# Altium schematic sheet PowerAndConnections.SchDoc: Sample Sheet Title
size B; Date: MM/DD/YYYY; Author: Sample Author; Organization: ORGANIZATION; Address1: ADDRESS 1; Address2: ADDRESS 2; Address3: ADDRESS 3; Address4: ADDRESS 4; Revision: -; SheetNumber: 1; SheetTotal: 6; ENG_APP_DATE: --/--/--; DSN_APP_DATE: --/--/--; CHK_APP_DATE: --/--/--
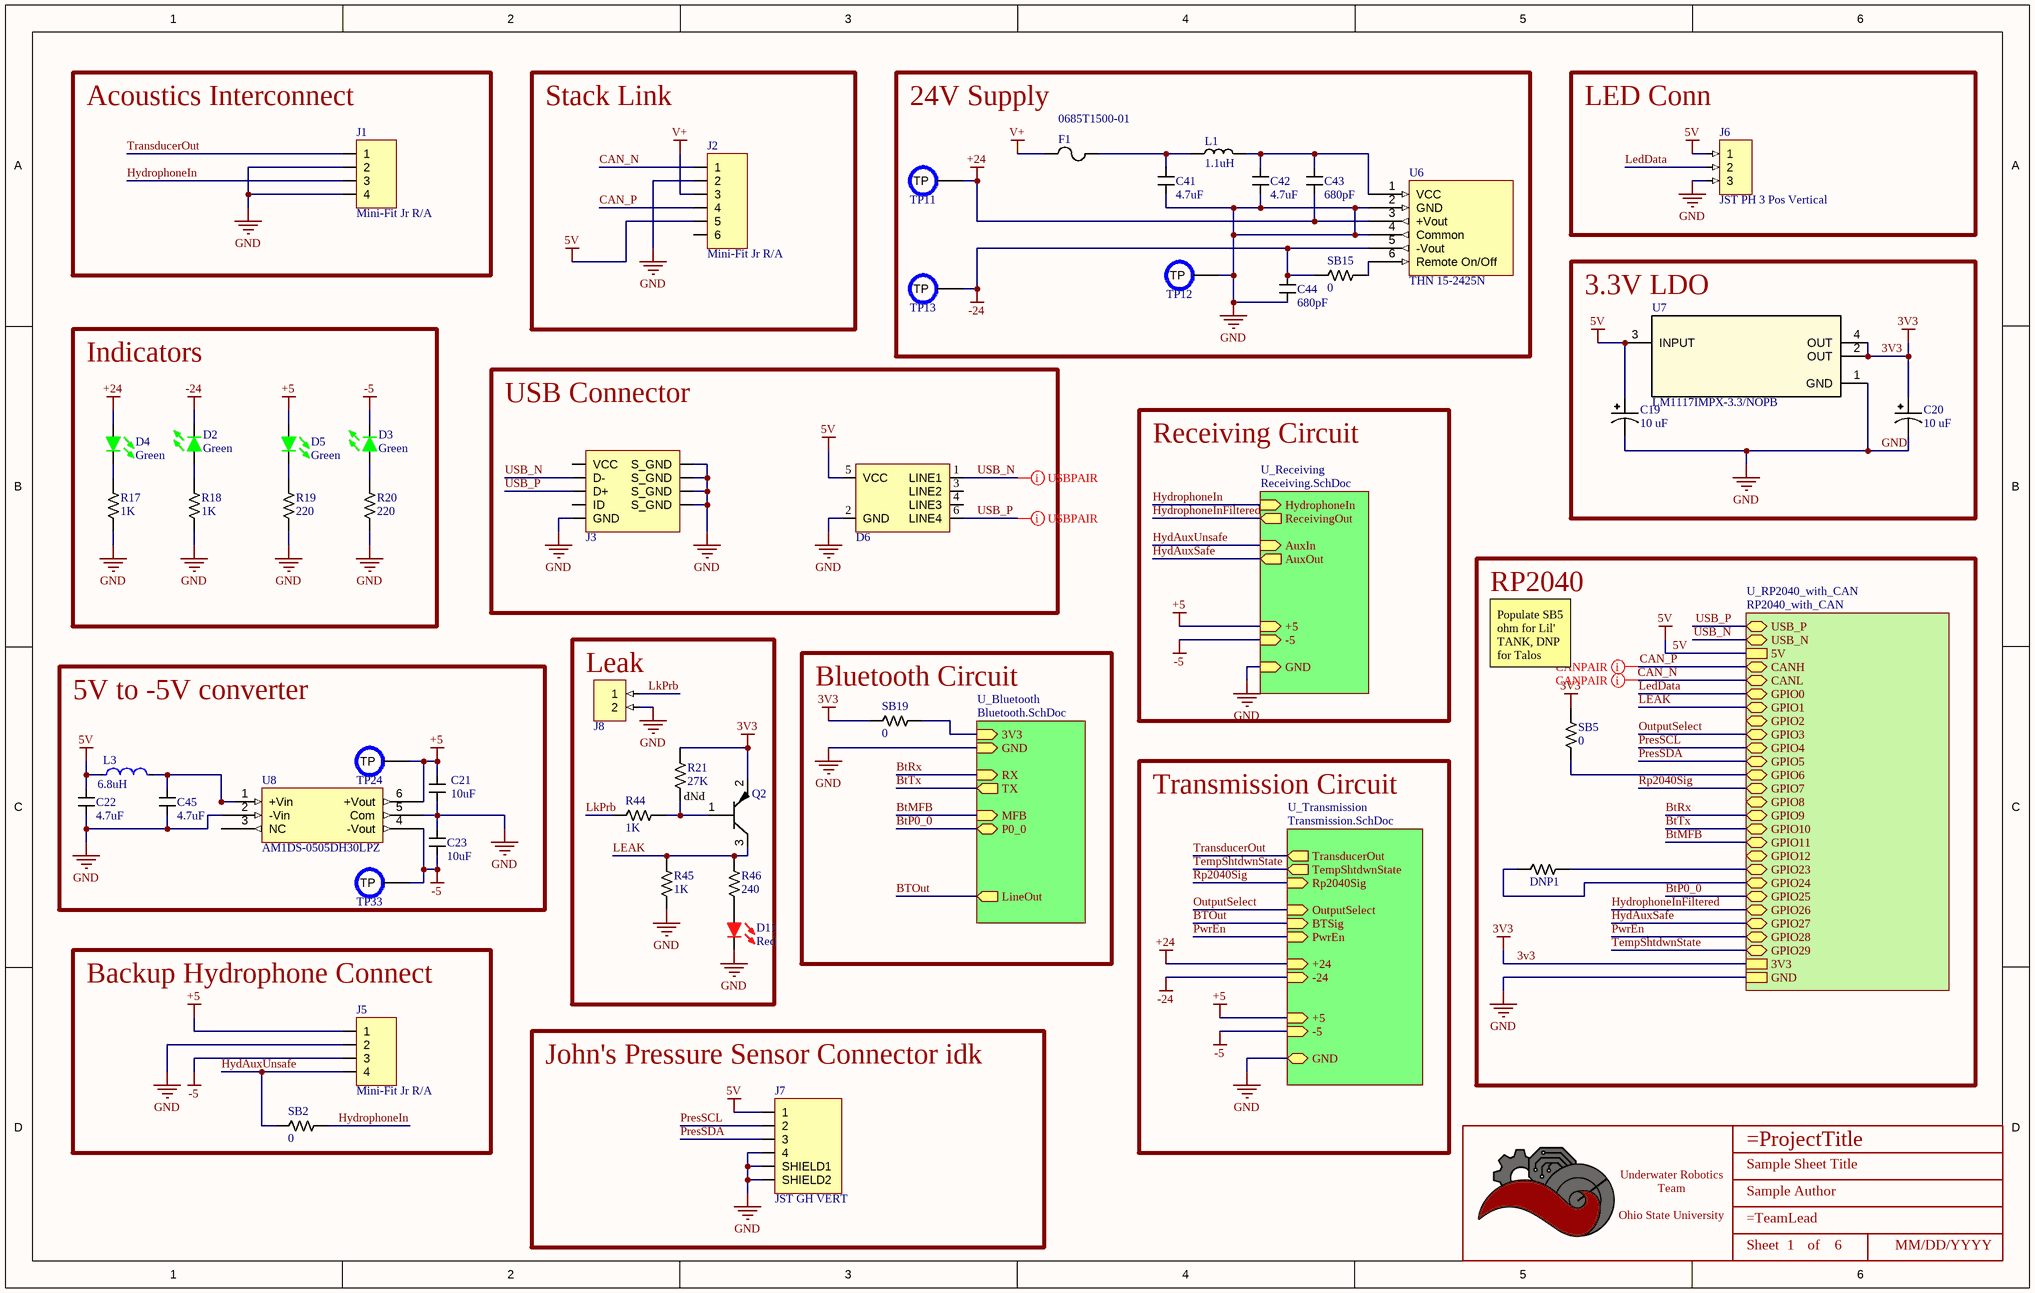
[diagram p0: PowerAndConnections.SchDoc]

## Parts
*  Title_Block  [LOGO]  (value not drawn)  (graphical)
C19  Value (uF): 10 uF  [CAPACITOR_1206 - POLAR]  (hidden comment: 10uF Tantalum 16V)
C20  Value (uF): 10 uF  [CAPACITOR_1206 - POLAR]  (hidden comment: 10uF Tantalum 16V)
C21  value 10uF  [CAPACITOR_0603]  (hidden comment: CL10X106MO8NRNC)
C22  value 4.7uF  [CAPACITOR_0603]  (hidden comment: 4.7uF Ceramic 6.3V)
C23  value 10uF  [CAPACITOR_0603]  (hidden comment: CL10X106MO8NRNC)
C41  value 4.7uF  [CAPACITOR_1206]  (hidden comment: AGC1206X7R500-475KXE*)
C42  value 4.7uF  [CAPACITOR_1206]  (hidden comment: AGC1206X7R500-475KXE*)
C43  value 680pF  [CAPACITOR_1808]  (hidden comment: CC1808KKX7REBB681)
C44  value 680pF  [CAPACITOR_1808]  (hidden comment: CC1808KKX7REBB681)
C45  value 4.7uF  [CAPACITOR_0603]  (hidden comment: 4.7uF Ceramic 6.3V)
D2  Color: Green  [LED_0603]  (hidden comment: 150060GS75000)
D3  Color: Green  [LED_0603]  (hidden comment: 150060GS75000)
D4  Color: Green  [LED_0603]  (hidden comment: 150060GS75000)
D5  Color: Green  [LED_0603]  (hidden comment: 150060GS75000)
D6  TVS DIODE 5VWM 25VC SOT23-6  [SOT 23-6L]  (value not drawn)
D11  Color: Red  [LED_0603]  (hidden comment: 150060RS75000)
DNP1  DNP  [RESISTOR_0402]  (value not drawn)
F1  0685T1500-01  [CAPACITOR_1206]
J1  Mini-Fit Jr R/A  [CONN_MOLEX_MINIFIT JR_4 POS_R/A]
J2  Mini-Fit Jr R/A  [CONN_MOLEX_MINIFIT JR_6 POS_R/A]
J3  USB_MICRO R/A  [CONN_MINIUSB]  (value not drawn)
J5  Mini-Fit Jr R/A  [CONN_MOLEX_MINIFIT JR_4 POS_R/A]
J6  JST PH 3 Pos Vertical  [CONN_JST_PH_3POS_VERT]
J7  JST GH VERT  [CONN_JST_BM04B-GHS-TBT(LF)(SN)(N)]
J8  CONN_JST_PH_2POS_VERT  [CONN_JST_PH_2POS_VERT]  (value not drawn)
L1  value 1.1uH  [INDUCTOR_TCK078]  (hidden comment: TCK-078)
L3  value 6.8uH  [INDUCTOR_0805]  (hidden comment: MLZ2012N6R8LT000)
Q2  PNP 60V 600mA SOT23  [SOT-23-3]  (value not drawn)
R17  Value  (Ohms): 1K  [RESISTOR_0603]  (hidden comment: 1k Ohm 5% 1/8W)
R18  Value  (Ohms): 1K  [RESISTOR_0603]  (hidden comment: 1k Ohm 5% 1/8W)
R19  Value  (Ohms): 220  [RESISTOR_0603]  (hidden comment: 220 Ohm 5% 1/8W)
R20  Value  (Ohms): 220  [RESISTOR_0603]  (hidden comment: 220 Ohm 5% 1/8W)
R21  Value  (Ohms): 27K  [RESISTOR_0603]  (hidden comment: 27k Ohm 5% 1/8W)
R44  Value  (Ohms): 1K  [RESISTOR_0603]  (hidden comment: 1k Ohm 5% 1/8W)
R45  Value  (Ohms): 1K  [RESISTOR_0603]  (hidden comment: 1k Ohm 5% 1/8W)
R46  Value  (Ohms): 240  [RESISTOR_0603]  (hidden comment: RES SMD 240 OHM 5% 1/10W 0603)
SB2  Value  (Ohms): 0  [RESISTOR_0603]  (hidden comment: 0 Ohm Jumper No Fit)
SB5  Value  (Ohms): 0  [RESISTOR_0603]  (hidden comment: 0 Ohm Jumper No Fit)
SB15  value 0  [RESISTOR_1206]  (hidden comment: JUMPER_0_1206)
SB19  Value  (Ohms): 0  [RESISTOR_0603]  (hidden comment: 0 Ohm Jumper No Fit)
TP11  PCB Test Point  [TESTPOINT_1.2MM]  (value not drawn)  (no BOM)
TP12  PCB Test Point  [TESTPOINT_1.2MM]  (value not drawn)  (no BOM)
TP13  PCB Test Point  [TESTPOINT_1.2MM]  (value not drawn)  (no BOM)
TP24  PCB Test Point  [TESTPOINT_1.2MM]  (value not drawn)  (no BOM)
TP33  PCB Test Point  [TESTPOINT_1.2MM]  (value not drawn)  (no BOM)
U6  THN 15-2425N  [THN_15-2425N]
U7  LM1117IMPX-3.3/NOPB  [SOT-223-4]
U8  AM1DS-0505DH30LPZ  [AM1DS-0505DH30LPZ]

## Blocks framed on the sheet
Acoustics Interconnect: J1
Stack Link: J2
24V Supply: C41-C44 F1 L1 SB15 TP11-TP13 U6
LED Conn: J6
3.3V LDO: C19 C20 U7
Indicators: D2-D5 R17-R20
USB Connector: D6 J3
RP2040: DNP1 SB5
5V to -5V converter: C21-C23 C45 L3 TP24 TP33 U8
Leak: D11 J8 Q2 R21 R44-R46
Bluetooth Circuit: SB19
Backup Hydrophone Connect: J5 SB2
John's Pressure Sensor Connector idk: J7

## Sub-sheets
U_Bluetooth = Bluetooth.SchDoc: 3V3 (in), GND (in), MFB (in), RX (in), TX (out), P0_0 (bidir), LineOut (out)
U_Receiving = Receiving.SchDoc: +5 (in), GND (in), HydrophoneIn (in), ReceivingOut (out), -5 (in), AuxIn (in), AuxOut (out)
U_RP2040_with_CAN = RP2040_with_CAN: USB_P (bidir), USB_N (bidir), 5V, CANH (bidir), CANL (bidir), GPIO0 (bidir), GPIO1 (bidir), GPIO2 (bidir), GPIO3 (bidir), GPIO4 (bidir), GPIO5 (bidir), GPIO6 (bidir), GPIO7 (bidir), GPIO8 (bidir), GPIO9 (bidir), GPIO10 (bidir), GPIO11 (bidir), GPIO12 (bidir), GPIO23 (bidir), GPIO24 (bidir), GPIO25 (bidir), GPIO26 (bidir), GPIO27 (bidir), GPIO28 (bidir), GPIO29 (bidir), 3V3, GND
U_Transmission = Transmission.SchDoc: TransducerOut (out), TempShtdwnState (out), +24 (in), -24 (in), +5 (in), -5 (in), GND (bidir), Rp2040Sig (in), OutputSelect (in), BTSig (in), PwrEn (in)

## Nets
3V3: C20.1 Q2.2 R21.1 SB5.1 SB19.2 U7.2(OUT) U7.4(OUT) ; sheet U_RP2040_with_CAN/3V3
5V: C19.1 C22.1 D6.5(VCC) J2.5 J6.1 J7.1 L3.1 U7.3(INPUT) ; sheet U_RP2040_with_CAN/5V
+5: C21.1 D5.1 J5.1 TP24.TP U8.6(+Vout) ; sheet U_Receiving/+5, sheet U_Transmission/+5
+24: C43.2 D4.1 TP11.TP U6.3(+Vout) ; sheet U_Transmission/+24
-5: C23.2 D3.2 J5.3 TP33.TP U8.4(-Vout) ; sheet U_Receiving/-5, sheet U_Transmission/-5
-24: C44.1 D2.2 SB15.2 TP13.TP U6.5(-Vout) ; sheet U_Transmission/-24
GND: C19.2 C20.2 C21.2 C22.2 C23.1 C41.2 C42.2 C44.2 C45.2 D6.2(GND) D11.2 J1.2 J1.4 J2.2 J3.5(GND) J3.6(S_GND) J3.7(S_GND) J3.8(S_GND) J3.9(S_GND) J5.2 J6.3 J7.4 J7.S1(SHIELD1) J7.S2(SHIELD2) J8.2 R17.2 R18.2 R19.2 R20.2 R45.2 TP12.TP U6.2(GND) U6.4(Common) U7.1(GND) U8.2(-Vin) U8.5(Com) ; sheet U_RP2040_with_CAN/GND, sheet U_Receiving/GND, sheet U_Bluetooth/GND, sheet U_Transmission/GND
V+: F1.1 J2.3
BtMFB: sheet U_RP2040_with_CAN/GPIO11, sheet U_Bluetooth/MFB
BTOut: sheet U_Bluetooth/LineOut, sheet U_Transmission/BTSig
BtP0_0: sheet U_RP2040_with_CAN/GPIO25, sheet U_Bluetooth/P0_0
BtRx: sheet U_RP2040_with_CAN/GPIO9, sheet U_Bluetooth/RX
BtTx: sheet U_RP2040_with_CAN/GPIO10, sheet U_Bluetooth/TX
CAN_N: J2.1 ; sheet U_RP2040_with_CAN/CANL
CAN_P: J2.4 ; sheet U_RP2040_with_CAN/CANH
HydAuxSafe: sheet U_RP2040_with_CAN/GPIO27, sheet U_Receiving/AuxOut
HydAuxUnsafe: J5.4 SB2.2 ; sheet U_Receiving/AuxIn
HydrophoneIn: J1.3 SB2.1 ; sheet U_Receiving/HydrophoneIn
HydrophoneInFiltered: sheet U_RP2040_with_CAN/GPIO26, sheet U_Receiving/ReceivingOut
LEAK: Q2.3 R45.1 R46.1 ; sheet U_RP2040_with_CAN/GPIO1
LedData: J6.2 ; sheet U_RP2040_with_CAN/GPIO0
LkPrb: J8.1 R44.2
OutputSelect: sheet U_RP2040_with_CAN/GPIO3, sheet U_Transmission/OutputSelect
PresSCL: J7.2 ; sheet U_RP2040_with_CAN/GPIO4
PresSDA: J7.3 ; sheet U_RP2040_with_CAN/GPIO5
PwrEn: sheet U_RP2040_with_CAN/GPIO28, sheet U_Transmission/PwrEn
Rp2040Sig: sheet U_RP2040_with_CAN/GPIO7, sheet U_Transmission/Rp2040Sig
TempShtdwnState: sheet U_RP2040_with_CAN/GPIO29, sheet U_Transmission/TempShtdwnState
TransducerOut: J1.1 ; sheet U_Transmission/TransducerOut
USB_N: D6.1(LINE1) J3.2(D-) ; sheet U_RP2040_with_CAN/USB_N
USB_P: D6.6(LINE4) J3.3(D+) ; sheet U_RP2040_with_CAN/USB_P
NetC41_1: C41.1 F1.2 L1.1
NetC42_1: C42.1 C43.1 L1.2 U6.1(VCC)
NetC45_1: C45.1 L3.2 U8.1(+Vin)
NetD2_1: D2.1 R18.1
NetD3_1: D3.1 R20.1
NetD4_2: D4.2 R17.1
NetD5_2: D5.2 R19.1
NetD11_1: D11.1 R46.2
NetDNP1_1: DNP1.1 ; sheet U_RP2040_with_CAN/GPIO23
NetDNP1_2: DNP1.2 ; sheet U_RP2040_with_CAN/GPIO24
NetQ2_1: Q2.1 R21.2 R44.1
NetSB5_2: SB5.2 ; sheet U_RP2040_with_CAN/GPIO6
NetSB15_1: SB15.1 U6.6(Remote_On/Off)
NetSB19_1: SB19.1 ; sheet U_Bluetooth/3V3

Not connected (* = marked no-connect by the designer): D6 3(LINE2) 4(LINE3); J2 6; J3 1(VCC) 4(ID); U8 3(NC)

## Layout directives
differential pair: CAN_N, CAN_P, USB_N, USB_P

## Notes on the sheet
- Receiving Circuit
- Populate SB5 ohm for Lil' TANK, DNP for Talos
- Transmission Circuit
- DWG. NO.
- REV.
- SHT.
- THIS DOCUMENT AND THE DATA DISCLOSED HEREIN OR HEREWITH IS THE PROPERTY OF ALTIUM LIMITED AND MAY BE FREELY DISTRIBUTED IN WHOLE. NO RIGHTS ARE RESERVED OR EXPRESS OR IMPLIED WARANTEE GIVEN.
- REVISION
- DESCRIPTION
- DATE
- APPROVED
- ENG:
- APPROVALS
- PROJECT
- DSN:
- CHK:
- REFERENCE DOCUMENTS
- PROJECT REVISION:
- TITLE
- DOCUMENT REVISION:
- DESIGN ITEM:
- BOM:
- FAB DWG:
- PCB DWG:
- ASSY DWG:
- SCALE:
- SIZE
- B
- CAGE CODE
- FILE NAME
- DWG NO.
- SHEET
- OF
- REV
- (in symbol Title_Block) Underwater Robotics Team / Ohio State University; Sheet; of

## Library data of the parts
* = Title_Block: UWRT Schematic Title Block Template / Created June 2021, Dylan Trainor
C19 C20 = CAPACITOR_10uF_1206_Tantalum_1: Cap 10uF 16V +/-20% / Tantalum 1206; Tolerance: +/- 10%; Made By: Dylan T; ComponentLink1Description: Digikey; ComponentLink1URL: https://www.digikey.com/en/products/detail/kyocera-avx/F981A106MMA/4004990; Voltage: 16V; Supplier 1: Newark; Supplier Part Number 1: 26AC4143
C21 C23 = CAP CER 10UF 16V X6S 0603: 10 µF ±20% 16V Ceramic Capacitor X6S 0603 (1608 Metric)
C22 C45 = CAPACITOR_4.7uF_0603: Cap 4.7uF 6.3V +/-10% / Ceramic 0603; Made By: Robert Pafford; Tolerance: +/- 10%; Voltage: 6.3V; Supplier 1: Digi-Key; Supplier Part Number 1: 1276-2087-1-ND
C41 C42 = 4.7u Auto Grade Capacitor,1206,X7R,50: 4.7 µF ±10% 50V Ceramic Capacitor X7R 1206 (3216 Metric)
C43 C44 = CAP CER 680PF 3KV X7R 1808
D2-D5 = LED_Green_0603_3.2V: LED Green Vf= 3.2V If = 0.025A / 150060GS75000; Made By: Flip B; Forward Current: 25mA; Supplier 1: Digi-Key; ComponentLink1Description: Datasheet; ComponentLink1URL: https://www.we-online.de/katalog/datasheet/150060GS75000.pdf; Supplier Part Number 1: 732-4971-1-ND; Forward Voltage: 3.2V; Package: 0603
D6 = RCLAMP0504S.TCT: 25V Clamp 6A (8/20µs) Ipp Tvs Diode Surface Mount SOT-23-6; Made By: Robert Pafford; Reverse Standoff Voltage (Typ): 5V; Breakdown Voltage (Min): 6V; Supplier 1: Digi-Key; Supplier Part Number 1: RCLAMP0504SCT-ND; Clamping Voltage (Max): 25V
D11 = LED_Red_0603: LED Red Vf= 2V If = 0.020A / 150060RS75000; Made By: Robert Pafford; Forward Current: 20mA; Forward Voltage: 2V; Package: 0603; Supplier 1: Digi-Key; Supplier Part Number 1: 732-4978-1-ND
DNP1 = DNP_0402: Do Not Populate 0402
F1 = 0685T1500-01: FUSE BRD MNT 1.5A 63VAC/VDC 1206
J1 J5 = CONN_MOLEX_MINIFIT JR_4POS_R/A: Molex Minifit Jr. 5569 / 4 Pos R/A Natural; Pitch: 4.2mm; Configuration: Right Angle; Current Per Pin: 13A; Number of Positions: 4; Supplier Part Number 1: WM13112-ND; Supplier 1: Digi-Key; Manufacturer: Molex; Color: Natural; Created By: Flip B; ComponentLink1Description: Datasheet; ComponentLink1URL: https://www.molex.com/pdm_docs/sd/026013115_sd.pdf; Series: Minifit Jr 5569
J2 = CONN_MOLEX_MINIFIT JR_6POS_R/A: Molex Minifit Jr. 5569 / 6 Pos R/A Natural; Pitch: 4.2mm; Configuration: Right Angle; Current Per Pin: 13A; Number of Positions: 8; Manufacturer: Molex; Color: Natural; Created By: Flip B; ComponentLink1Description: Datasheet; ComponentLink1URL: https://www.molex.com/pdm_docs/ps/PS-5556-001.pdf; Series: Minifit Jr 5569; Supplier 1: Digi-Key; Supplier Part Number 1: WM1353-ND
J3 = CONN_MICROUSB: Amphenol Micro USB-B / USB2.0 5 Pin Right Angle SMD; Pitch: 0.65mm; Current Per Pin: 1.8A; Number of Positions: 5; Manufacturer: Amphenol; Configuration: Right Angle; Color: Silver; Created By: Flip B; ComponentLink1Description: Datasheet; ComponentLink1URL: https://cdn.amphenol-icc.com/media/wysiwyg/files/documentation/datasheet/inputoutput/io_usb_micro.pdf?__cf_chl_jschl_tk__=05693735e19256298f6ef6ca2bb2e65c376a4f56-1625503833-0-Abitsb0-ufjOXJYs_S3J3r2iTn-nObalbmXUksF1VvO_h_WEmRdMlUD1I8-hmWSEVWzY1pirKnrPZWfgY3851qyBZe5ZvnNQePLGIzUgdEIQBVUyW36RsbYpDLEWxJ4horD-5gChFgobLYqwmG5aHl0E8lIn_twwPPrOxilK2gP0q9t_CNOs_u5fMqXvXUrlsOv8tIE2NRlu6NVP8qtkL2GjhlkeTUbDMF8WvvpPDTFOgvZ4Y16Ej8F8AhWos88mo5B1HssXozw0XrkJQIqERITUu6rqloz9kf4ZzhBHtDAt-IkiAFY_Ds9SW8FYKKTtINJVpHZQ6Gyu1FFM4Dc9MO0maE8_mmNcwlxqyRoRk_MPWW8VyByXWM5RSp52jteRKw7FeI9WIYvCbPAOy0Eyib-aseIQsnGbglBcUY6_2xp8GYaJM38H3dNvBPsSOfJBPndKedwKHllxjkucXn6xsN0sDXkpGN-cu8_2bDTJ0g-uUucKSCooYX-ApSDNGpkA_p9zv1SOAD8c0zaZVmtiBsN75QpVz2rzq9_BFxOywPvR; Series: 10118192; Supplier 1: Digi-Key; Supplier Part Number 1: 609-4613-1-ND
J6 = CONN_JST_PH_3POS_VERT
J7 = CONN_JST_GH_4POS_VERT: JST GH Pitch 4 Pos Vertical; Pitch: 1.25mm; Current Per Pin: 1A; Number of Positions: 4; Manufacturer: JST; Configuration: Vertical; Color: Natural; Created By: Robert P; Series: GH; Supplier 1: Digi-Key; Supplier Part Number 1: 455-1580-1-ND
J8 = CONN_JST_PH_2POS_VERT: JST PH 2 Pos Vert
L1 = FIXED IND 1.1UH 3.24A 15 MOHM: 1.1 µH Unshielded Inductor 3.24 A 15mOhm Max Nonstandard
L3 = INDUCTOR_6.8uH_Shielded Multilayer ±20% 550mA 325mΩ SMD 0805: Shielded Multilayer Inductor 6.8uH ±20% 550mA 325mΩ SMD 0805; Test Frequency: 2MHz; Self Resonant Frequency: 60MHz; Saturation Current: 110mA; Core Material: Ferrite; DC Resistance (DCR): 250mR; Current Rating: 550mA; Case/Package: 0805; Height - Seated (Max): 0.057inch; Lead Free: Lead Free; Mount: Surface Mount; Max Operating Temperature: 125°C; Length: 0.079inch; Min Operating Temperature: -55°C; RoHS Compliant: Yes; Case Code (Imperial): 0805; Shielding: Shielded; Tolerance: 20%; Width: 0.049inch; Inductance: 6.8uH; Packaging: Tape and Reel; Package Quantity: 1; Case Code (Metric): 2012
Q2 = MMBT2907A-7-F: PNP 60 V 600mA Surface Mount SOT-23; Vendor: Digikey; Vgs (Max): ±10V; Vgs (th): 800mV @ 250µA; Vdss: 20 V; Power Dissipation: 1.56W (Tc); Rds (on): 50mOhm @ 3A, 4.5V; Amp Rating: 600mA; BJT Type: PNP; Package: TO-236-3, SC-59, SOT-23-3; Manufacturer_Part_Number: MMBT2907A-7-F; Created By: Robert Pafford; ComponentLink1Description: Datasheet; ComponentLink1URL: https://media.digikey.com/pdf/Data%20Sheets/Diodes%20PDFs/MMBT2907A_Rev2016.pdf; Supplier 1: Digi-Key; Supplier Part Number 1: MMBT2907A-FDICT-ND
R17 R18 R44 R45 = RESISTOR_1K_0603: RES 1k OHM 5% 1/8W 0603; Tolerance: +/- 5%; Made By: Robert Pafford; ComponentLink1Description: Datasheet; ComponentLink1URL: https://www.bourns.com/docs/product-datasheets/CRxxxxx.pdf; Wattage: 1/8W; Supplier: Digikey; Digikey Part Numer: CR0603-JW-104ELFTR-ND; Supplier 1: Digi-Key; Supplier Part Number 1: 2019-RK73B1JTTD102JCT-ND
R19 R20 = RESISTOR_200_0603: RES 220 OHM 5% 1/8W 0603; Tolerance: +/- 5%; Made By: John S; ComponentLink1Description: Digikey; ComponentLink1URL: https://www.digikey.com/en/products/detail/koa-speer-electronics-inc/RK73B1JTTD101J/9844701; Wattage: 1/8W; Supplier 1: Digi-Key; Supplier Part Number 1: 2019-RK73B1JTTD221JCT-ND
R21 = RESISTOR_27K_0603_1: RES SMD 27K OHM 5% 1/10W 0603; Tolerance: +/- 5%; Made By: John Ulm; ComponentLink1Description: Datasheet; ComponentLink1URL: https://www.bourns.com/docs/product-datasheets/CRxxxxx.pdf; Wattage: 1/10W; Supplier: Digikey; Digikey Part Numer: ERJ-3GEYJ273V; Supplier 1: Digikey; Supplier Part Number 1: P27KGCT-ND
R46 = RESISTOR_240_0603: Tolerance: +/- 5%; Made By: John Ulm; ComponentLink1Description: Datasheet; ComponentLink1URL: https://www.bourns.com/docs/product-datasheets/CRxxxxx.pdf; Wattage: 1/10W; Supplier: Digikey; Digikey Part Numer: ERJ-3GEYJ241V; Supplier 1: Digikey; Supplier Part Number 1: P240GCT-ND
SB2 SB5 SB19 = JUMPER_0_0603: 0 Ohm Jumper No Fit for Solder Bridge; Made By: Robert Pafford; ComponentLink1Description: Digikey; ComponentLink1URL: https://www.digikey.com/en/products/detail/koa-speer-electronics-inc/RK73B1JTTD101J/9844701
SB15 = JUMPER_0_1206: JUMPER 0OHM
TP11-TP13 TP24 TP33 = TESTPOINT: Made By: Robert Pafford
U6 = THN 15-2425N: DC DC CONVERTER +/-24V 15W
U7 = LM1117IMPX-3.3/NOPB: IC REG LIN 3.3V 800MA SOT223-4; PartNumber: LM1117IMP-3.3/NOPB; Manufacturer: Texas Instruments; Vin (Max): 15V; Supplier 1: Digi-Key; Supplier Part Number 1: LM1117IMPX-3.3/NOPBCT-ND; Vout (Min/Fixed): 3.3V; Amp Out: 800mA; Package: SOT-223-4; Created By: Dylan T
U8 = AM1DS-0505DH30LPZ: Isolated Module DC DC Converter 2 Output -5V 5V 100mA, 100mA 4.5V - 5.5V Input